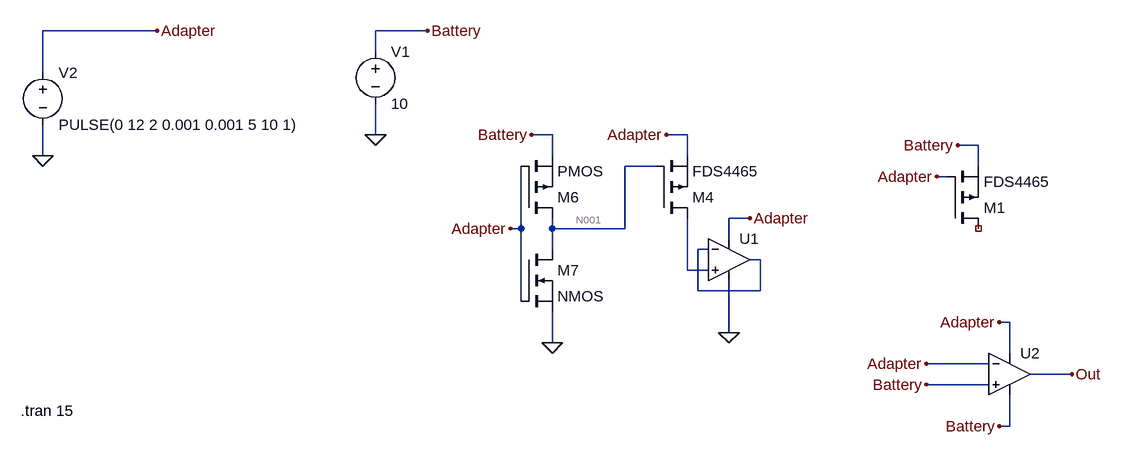
[diagram p0: schematic Design 2.asc]
Design 2.asc, the LTspice schematic file:
Version 4
SHEET 1 1456 876
WIRE -464 208 -640 208
WIRE -48 208 -128 208
WIRE -128 240 -128 208
WIRE -640 272 -640 208
WIRE -128 368 -128 320
WIRE 144 368 112 368
WIRE 352 368 320 368
WIRE 800 384 768 384
WIRE -640 400 -640 352
WIRE 144 400 144 368
WIRE 352 400 352 368
WIRE 304 416 256 416
WIRE 800 416 800 384
WIRE 752 432 736 432
WIRE 448 496 416 496
WIRE 96 512 96 416
WIRE 96 512 80 512
WIRE 144 512 144 496
WIRE 256 512 256 416
WIRE 256 512 144 512
WIRE 416 528 416 496
WIRE 144 544 144 512
WIRE 384 544 368 544
WIRE 464 560 448 560
WIRE 352 576 352 496
WIRE 384 576 352 576
WIRE 368 608 368 544
WIRE 464 608 464 560
WIRE 464 608 368 608
WIRE 96 624 96 512
WIRE 848 656 832 656
WIRE 416 672 416 592
WIRE 144 688 144 640
WIRE 848 704 848 656
WIRE 816 720 720 720
WIRE 944 736 880 736
WIRE 816 752 720 752
WIRE 848 816 848 768
WIRE 848 816 832 816
FLAG -640 400 0
FLAG -464 208 Adapter
FLAG -128 368 0
FLAG -48 208 Battery
FLAG 320 368 Adapter
FLAG 768 384 Battery
FLAG 736 432 Adapter
FLAG 80 512 Adapter
FLAG 144 688 0
FLAG 112 368 Battery
FLAG 416 672 0
FLAG 448 496 Adapter
FLAG 832 656 Adapter
FLAG 832 816 Battery
FLAG 720 720 Adapter
FLAG 720 752 Battery
FLAG 944 736 Out
SYMBOL voltage -128 224 R0
SYMATTR InstName V1
SYMATTR Value 10
SYMBOL voltage -640 256 R0
WINDOW 123 0 0 Left 0
WINDOW 39 0 0 Left 0
SYMATTR InstName V2
SYMATTR Value PULSE(0 12 2 0.001 0.001 5 10 1)
SYMBOL pmos 304 496 M180
SYMATTR InstName M4
SYMATTR Value FDS4465
SYMBOL pmos 96 496 M180
SYMATTR InstName M6
SYMBOL nmos 96 544 R0
SYMATTR InstName M7
SYMBOL pmos 752 512 M180
SYMATTR InstName M1
SYMATTR Value FDS4465
SYMBOL OpAmps\\UniversalOpAmp 416 560 R0
SYMATTR InstName U1
SYMBOL OpAmps\\UniversalOpamp2 848 736 R0
SYMATTR InstName U2
TEXT -674 792 Left 2 !.tran 15

The netlist it stands for:
* Design 2.asc
V1 Battery 0 10
V2 Adapter 0 PULSE(0 12 2 0.001 0.001 5 10 1)
M4 N003 N001 Adapter Adapter FDS4465
M6 N001 Adapter Battery Battery PMOS
M7 N001 Adapter 0 0 NMOS
M1 NC_01 Adapter Battery Battery FDS4465
XU1 N003 N002 Adapter 0 N002 level1 Avol=1Meg GBW=10Meg Vos=0 En=0 Enk=0 In=0 Ink=0 Rin=500Meg  ; pins In+ In- V+ V- OUT
XU2 Battery Adapter Adapter Battery Out level.2 Avol=1Meg GBW=10Meg Slew=10Meg ilimit=25m rail=0 Vos=0 phimargin=45 en=0 enk=0 in=0 ink=0 Rin=500Meg  ; pins IN+ IN- V+ V- OUT
.model NMOS NMOS
.model PMOS PMOS
.lib standard.mos
.tran 15
.lib UniversalOpAmp1.lib
.lib UniversalOpamps2.sub
.backanno
.end

* Results of the author's LTspice run, read from the files saved beside the schematic
* Operating Point, zero values left out:
*   V(battery) = 10 V
*   V(n001) = 10 V
*   V(out) = 4.975 V
*   Id(M7) = 20.01 pA
*   Ib(M7) = -10.01 pA
*   Is(M7) = -10 pA
*   Id(M6) = -20.01 pA
*   Is(M6) = 20.01 pA
*   I(V2) = 1.263 A
*   I(V1) = -1.263 A
*   Ix(u2:1) = 10 nA
*   Ix(u2:2) = -10 nA
*   Ix(u2:3) = -1.263 A
*   Ix(u2:4) = 1.263 A
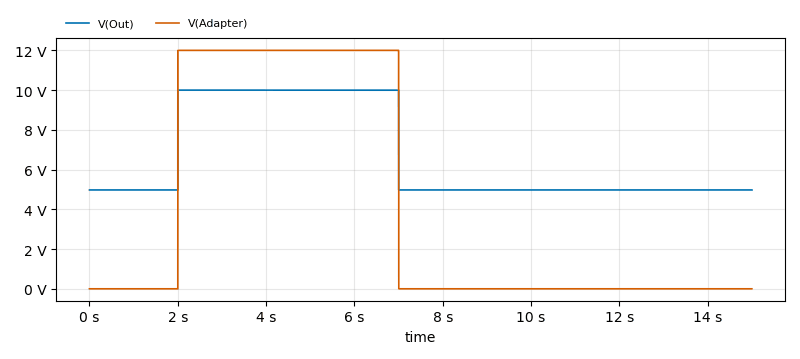
[diagram p1: Transient Analysis of Design 2.asc, plotted from the saved traces]
* Transient Analysis, 1 run:
*   V(Out): min 4.975 V, max 10.03 V, average 6.65 V, rms 7.06 V, last 4.975 V
*   V(Adapter): min 0 V, max 12 V, average 4.001 V, rms 6.929 V, last 0 V